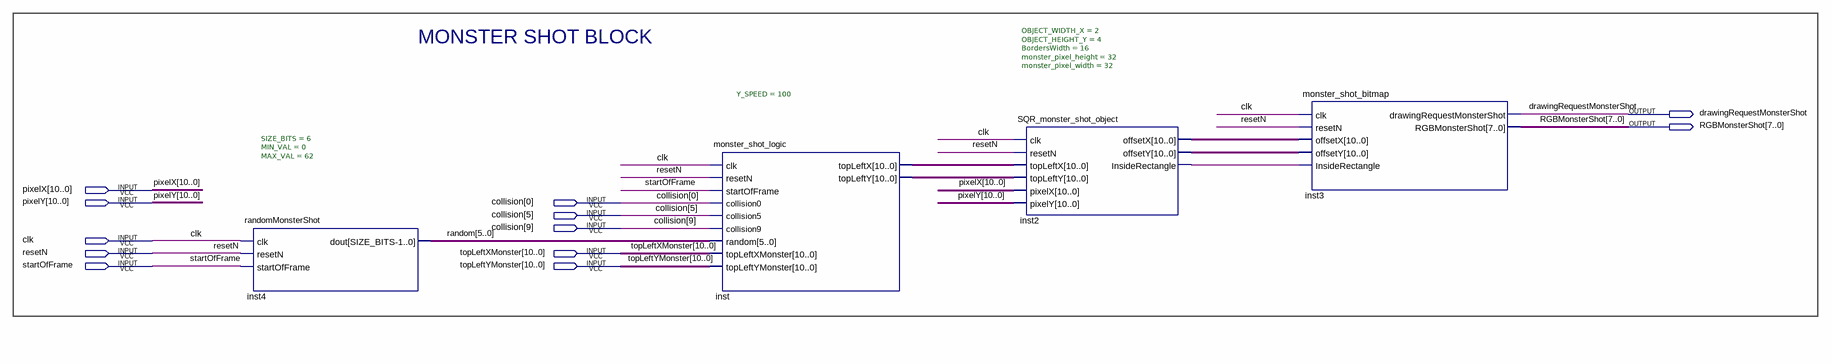
[diagram p0: schematic sheet]
// Quartus schematic Monster_Shot_Block.bdf as structural Verilog: 4 symbols, 12 pins
module Monster_Shot_Block (
  input  [10:0] pixelX,
  input  [10:0] pixelY,
  input  [9:0] collision,
  input  clk,
  input  resetN,
  input  [10:0] topLeftXMonster,
  input  startOfFrame,
  input  [10:0] topLeftYMonster,
  output drawingRequestMonsterShot,
  output [7:0] RGBMonsterShot
);

  wire inst2_insiderectangle;
  wire [5:0] random;
  wire [10:0] inst2_offsetx, inst2_offsety, inst_topleftx, inst_toplefty;

  randomMonsterShot #(.SIZE_BITS(6), .MIN_VAL(0), .MAX_VAL(62)) inst4 (
    .clk(clk), .resetN(resetN), .startOfFrame(startOfFrame), .dout(random));
  monster_shot_logic #(.Y_SPEED(100)) inst (
    .clk(clk), .resetN(resetN), .startOfFrame(startOfFrame), .collision0(collision[0]),
    .collision5(collision[5]), .collision9(collision[9]), .random(random), .topLeftXMonster(topLeftXMonster),
    .topLeftYMonster(topLeftYMonster), .topLeftX(inst_topleftx), .topLeftY(inst_toplefty));
  SQR_monster_shot_object #(.OBJECT_WIDTH_X(2), .OBJECT_HEIGHT_Y(4), .BordersWidth(16), .monster_pixel_height(32), .monster_pixel_width(32)) inst2 (
    .clk(clk), .resetN(resetN), .topLeftX(inst_topleftx), .topLeftY(inst_toplefty), .pixelX(pixelX),
    .pixelY(pixelY), .offsetX(inst2_offsetx), .offsetY(inst2_offsety), .InsideRectangle(inst2_insiderectangle));
  monster_shot_bitmap inst3 (
    .clk(clk), .resetN(resetN), .offsetX(inst2_offsetx), .offsetY(inst2_offsety),
    .InsideRectangle(inst2_insiderectangle), .drawingRequestMonsterShot(drawingRequestMonsterShot),
    .RGBMonsterShot(RGBMonsterShot));

  // Notes on the sheet:
  //   MONSTER SHOT BLOCK
endmodule
